# Altium schematic sheet SigGen.SchDoc
size A2
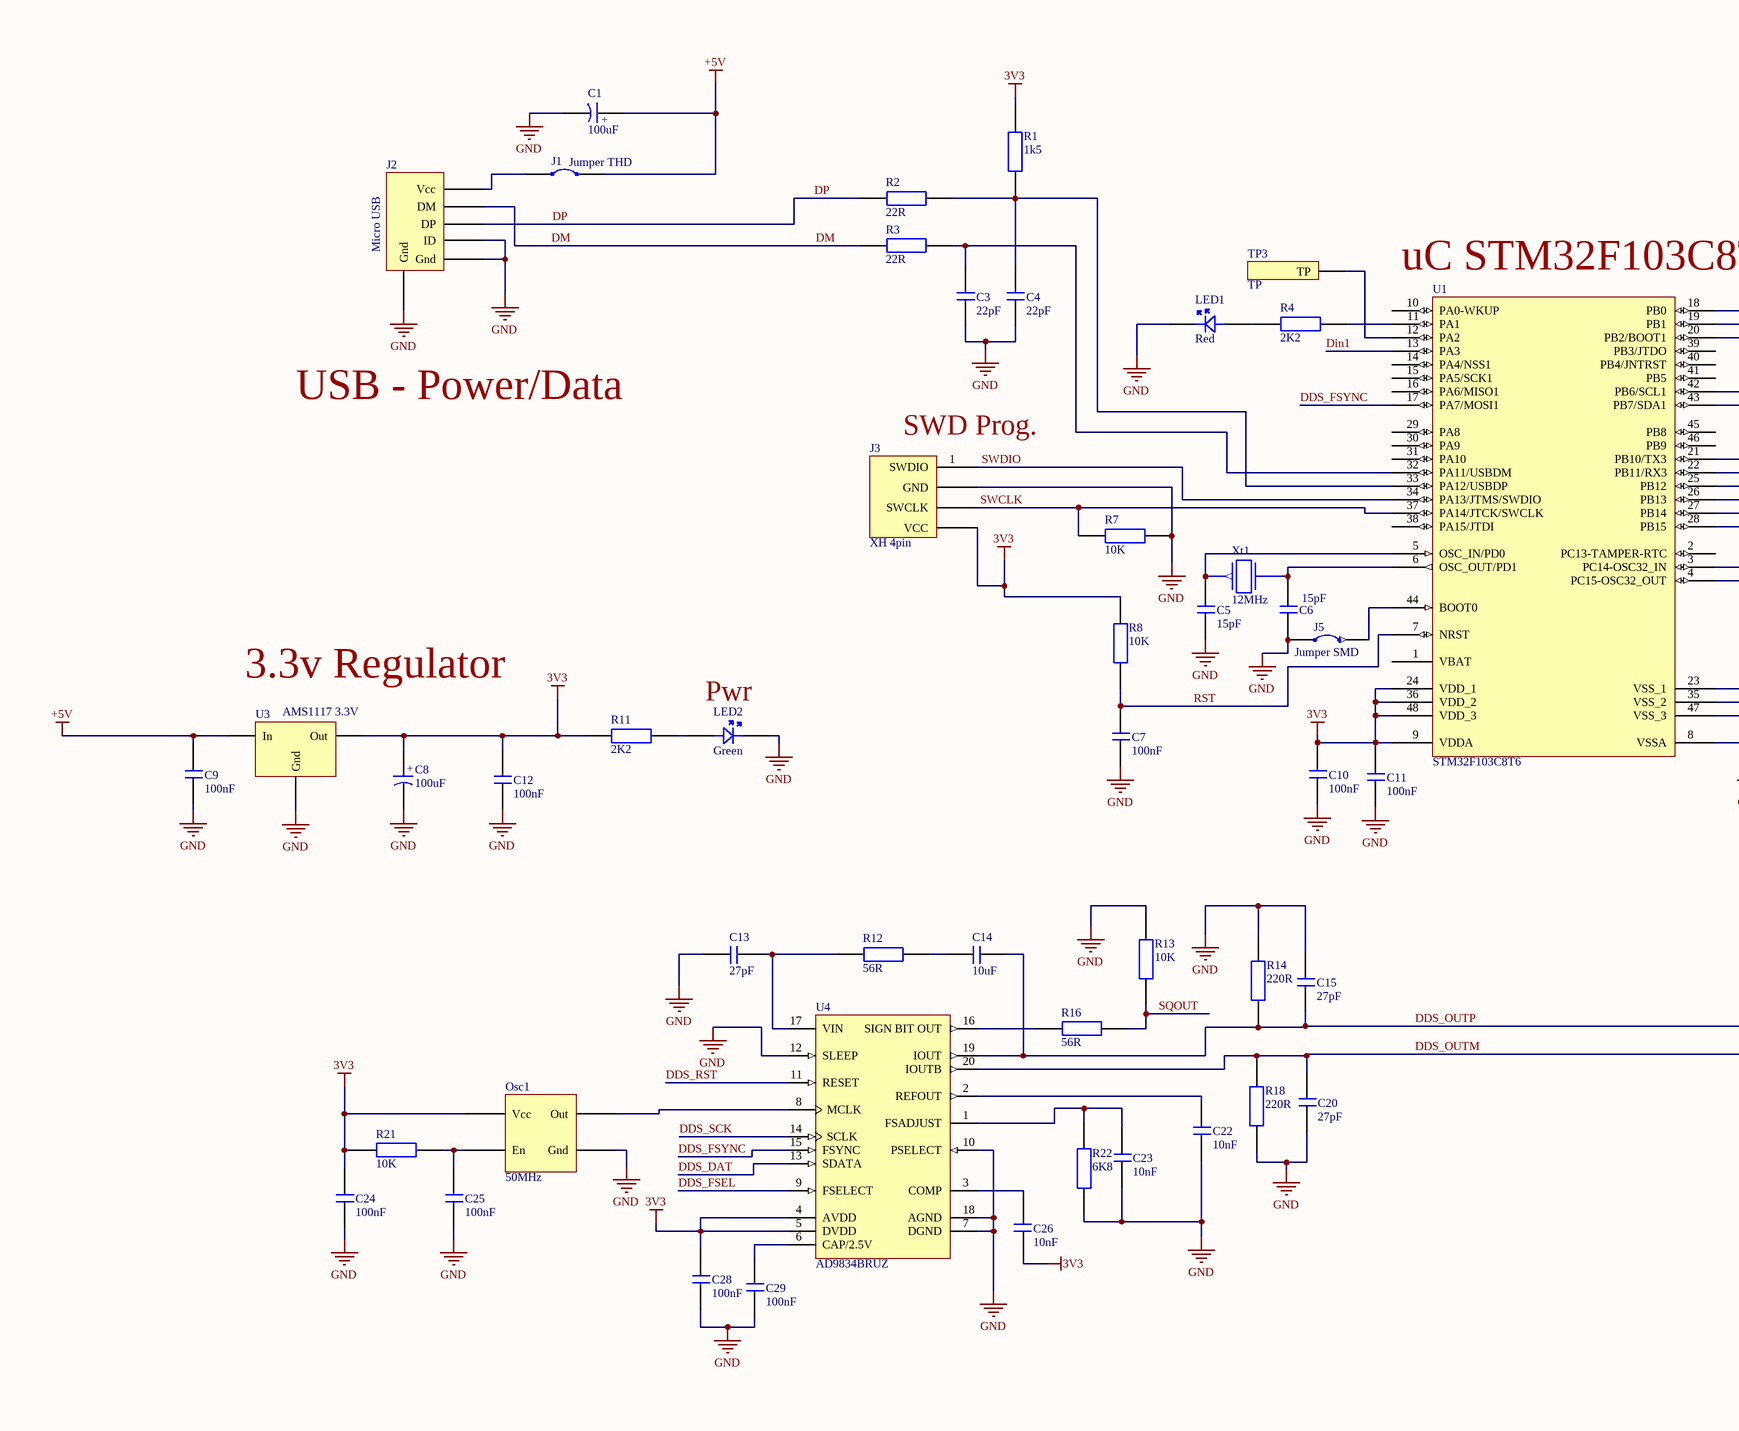
[diagram p0: SigGen.SchDoc, left]
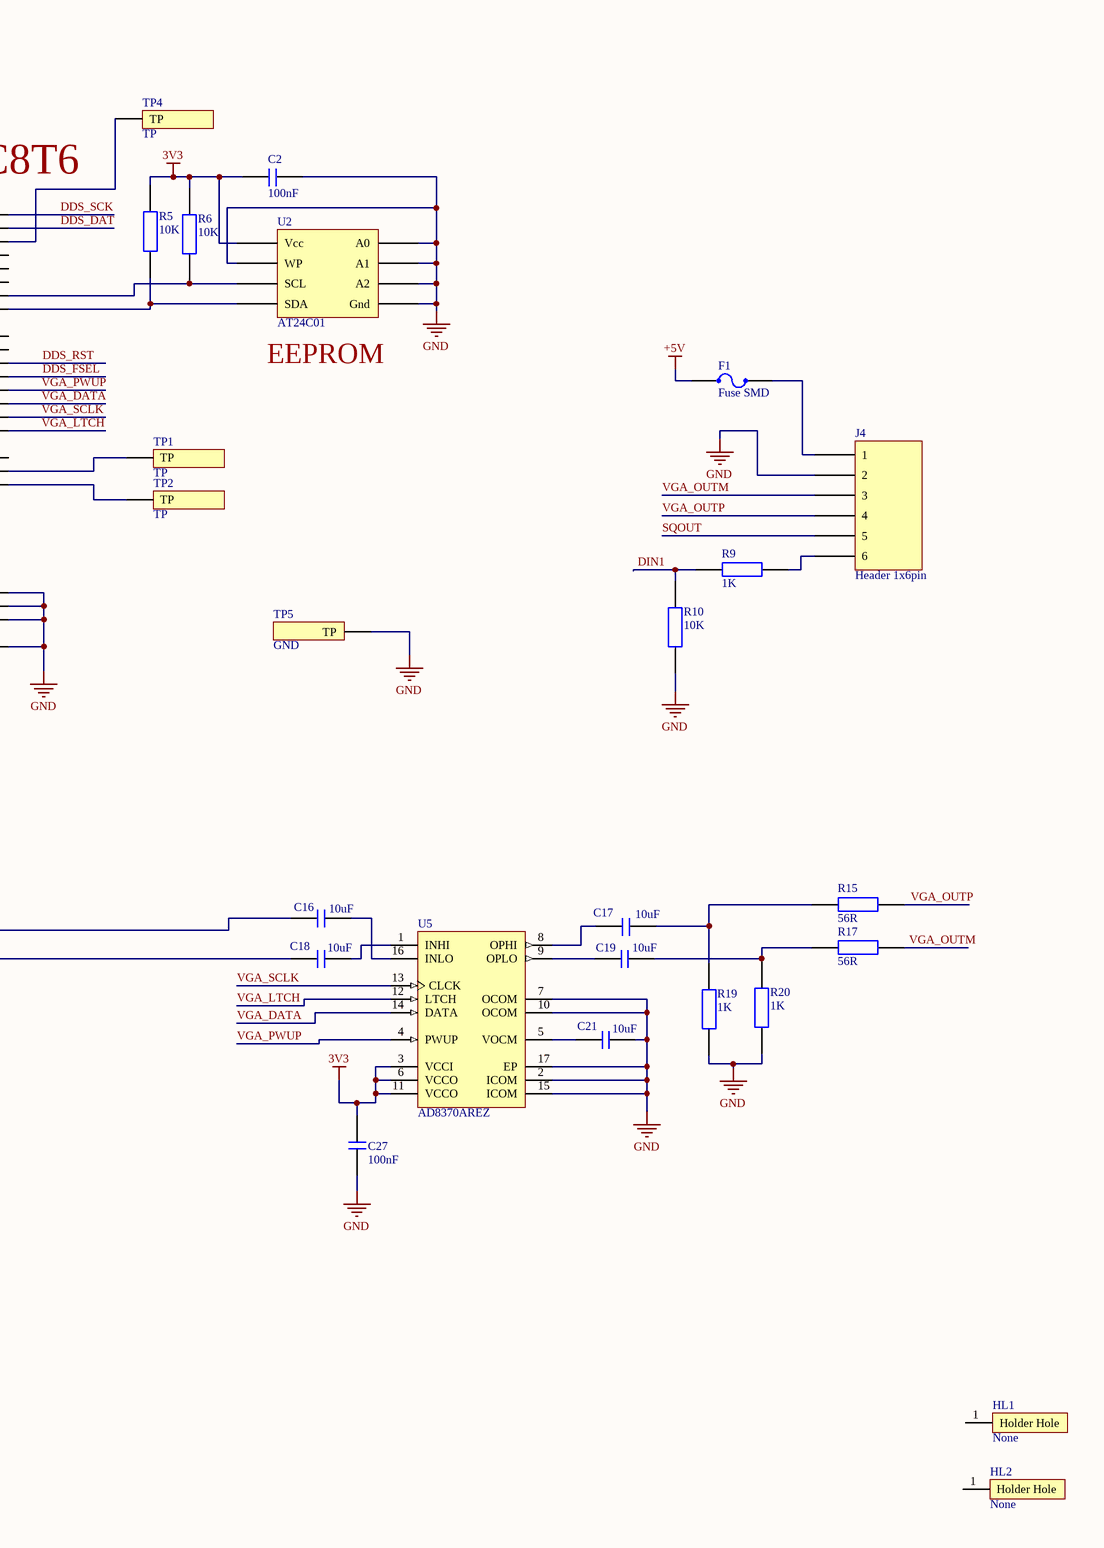
[diagram p1: SigGen.SchDoc, right]

## Parts
C1  100uF  [Cap_Tan_Size_B]
C2  100nF  [CAP_0805]
C3  22pF  [CAP_0805]
C4  22pF  [CAP_0805]
C5  15pF  [CAP_0805]
C6  15pF  [CAP_0805]
C7  100nF  [CAP_0805]
C8  100uF  [Cap_Tan_Size_B]
C9  100nF  [CAP_0805]
C10  100nF  [CAP_0805]
C11  100nF  [CAP_0805]
C12  100nF  [CAP_0805]
C13  27pF  [CAP_0805]
C14  10uF  [CAP_0805]
C15  27pF  [CAP_0805]
C16  10uF  [CAP_0805]
C17  10uF  [CAP_0805]
C18  10uF  [CAP_0805]
C19  10uF  [CAP_0805]
C20  27pF  [CAP_0805]
C21  10uF  [CAP_0805]
C22  10nF  [CAP_0805]
C23  10nF  [CAP_0805]
C24  100nF  [CAP_0805]
C25  100nF  [CAP_0805]
C26  10nF  [CAP_0805]
C27  100nF  [CAP_0805]
C28  100nF  [CAP_0805]
C29  100nF  [CAP_0805]
F1  Fuse SMD  [fuse_1206]
HL1  None  [Holder_hole]  (no BOM)
HL2  None  [Holder_hole]  (no BOM)
J1  Jumper THD  [Jumper_2pin]
J2  Micro USB  [Micro_USB_smd]
J3  XH 4pin  [XH-4pin]
J4  Header 1x6pin  [Header_1x6]
J5  Jumper SMD  [Jumper_smd]  (no BOM)
LED1  Red  [LED_0805_Red]
LED2  Green  [LED_0805_Green]
Osc1  50MHz  [Osc_SMD_5x7]
R1  1k5  [RES_0805]
R2  22R  [RES_0805]
R3  22R  [RES_0805]
R4  2K2  [RES_0805]
R5  10K  [RES_0805]
R6  10K  [RES_0805]
R7  10K  [RES_0805]
R8  10K  [RES_0805]
R9  1K  [RES_0805]
R10  10K  [RES_0805]
R11  2K2  [RES_0805]
R12  56R  [RES_0805]
R13  10K  [RES_0805]
R14  220R  [RES_0805]
R15  56R  [RES_0805]
R16  56R  [RES_0805]
R17  56R  [RES_0805]
R18  220R  [RES_0805]
R19  1K  [RES_0805]
R20  1K  [RES_0805]
R21  10K  [RES_0805]
R22  6K8  [RES_0805]
TP1  TP  [TP]  (no BOM)
TP2  TP  [TP]  (no BOM)
TP3  TP  [TP]  (no BOM)
TP4  TP  [TP]  (no BOM)
TP5  GND  [TP]  (no BOM)
U1  STM32F103C8T6  [STM32F103C8-LQFP-48]
U2  AT24C01  [AT24C01_SOP8]
U3  AMS1117 3.3V  [AMS1117-SOT223]
U4  AD9834BRUZ  [TSSOP-20]
U5  AD8370AREZ  [TSSOP-16-EP]
Xt1  12MHz  [Xtal_SMD]

## Nets
3V3: C2.1 C8.+ C10.2 C11.2 C12.2 C24.2 C26.2 C27.2 C28.2 J3.4(VCC) Osc1.1(Vcc) R1.2 R5.2 R6.2 R8.2 R11.2 R21.2 U1.9(VDDA) U1.24(VDD_1) U1.36(VDD_2) U1.48(VDD_3) U2.8(Vcc) U3.3(Out) U4.4(AVDD) U4.5(DVDD) U5.3(VCCI) U5.6(VCCO) U5.11(VCCO)
+5V: C1.+ C9.2 F1.2 J1.1 U3.1(In)
GND: C1.- C2.2 C3.1 C4.1 C5.1 C6.1 C7.1 C8.- C9.1 C10.1 C11.1 C12.1 C13.1 C15.2 C20.1 C21.2 C22.1 C23.1 C24.1 C25.1 C27.1 C28.1 C29.1 J2.4(ID) J2.5(Gnd) J2.6(Gnd) J3.2(GND) J4.2 J5.2 LED1.2 LED2.2 Osc1.4(Gnd) R7.2 R10.1 R13.2 R14.2 R18.1 R19.1 R20.1 R22.2 TP5.1(TP) U1.8(VSSA) U1.23(VSS_1) U1.35(VSS_2) U1.47(VSS_3) U2.1(A0) U2.2(A1) U2.3(A2) U2.4(Gnd) U2.7(WP) U3.2(Gnd) U4.7(DGND) U4.10(PSELECT) U4.12(SLEEP) U4.18(AGND) U5.2(ICOM) U5.7(OCOM) U5.10(OCOM) U5.15(ICOM) U5.17(EP)
DDS_DAT: U1.19(PB1) U4.13(SDATA)
DDS_FSEL: U1.22(PB11/RX3) U4.9(FSELECT)
DDS_FSYNC: U1.17(PA7/MOSI1) U4.15(FSYNC)
DDS_OUTM: C18.1 C20.2 R18.2 U4.20(IOUTB)
DDS_OUTP: C14.2 C15.1 C16.1 R14.1 U4.19(IOUT)
DDS_RST: U1.21(PB10/TX3) U4.11(RESET)
DDS_SCK: U1.18(PB0) U4.14(SCLK)
DIN1: R9.1 R10.2 U1.13(PA3)
DM: J2.2(DM) R3.2
DP: J2.3(DP) R2.2
RST: C7.2 R8.1 U1.7(NRST)
SQOUT: J4.5 R13.1 R16.2
SWCLK: J3.3(SWCLK) R7.1 U1.37(PA14/JTCK/SWCLK)
SWDIO: J3.1(SWDIO) U1.34(PA13/JTMS/SWDIO)
VGA_DATA: U1.26(PB13) U5.14(DATA)
VGA_LTCH: U1.28(PB15) U5.12(LTCH)
VGA_OUTM: J4.3 R17.2
VGA_OUTP: J4.4 R15.2
VGA_PWUP: U1.25(PB12) U5.4(PWUP)
VGA_SCLK: U1.27(PB14) U5.13(CLCK)
NetC3_2: C3.2 R3.1 U1.32(PA11/USBDM)
NetC4_2: C4.2 R1.1 R2.1 U1.33(PA12/USBDP)
NetC5_2: C5.2 U1.5(OSC_IN/PD0) Xt1.1
NetC6_2: C6.2 U1.6(OSC_OUT/PD1) Xt1.2
NetC13_2: C13.2 R12.1 U4.17(VIN)
NetC14_1: C14.1 R12.2
NetC16_2: C16.2 U5.16(INLO)
NetC17_1: C17.1 U5.8(OPHI)
NetC17_2: C17.2 R15.1 R19.2
NetC18_2: C18.2 U5.1(INHI)
NetC19_1: C19.1 U5.9(OPLO)
NetC19_2: C19.2 R17.1 R20.2
NetC21_1: C21.1 U5.5(VOCM)
NetC22_2: C22.2 U4.2(REFOUT)
NetC23_2: C23.2 R22.1 U4.1(FSADJUST)
NetC25_2: C25.2 Osc1.2(En) R21.1
NetC26_1: C26.1 U4.3(COMP)
NetC29_2: C29.2 U4.6(CAP/2.5V)
NetF1_1: F1.1 J4.1
NetJ1_2: J1.2 J2.1(Vcc)
NetJ4_6: J4.6 R9.2
NetJ5_1: J5.1 U1.44(BOOT0)
NetLED1_1: LED1.1 R4.2
NetLED2_1: LED2.1 R11.1
NetOsc1_3: Osc1.3(Out) U4.8(MCLK)
NetR4_1: R4.1 U1.11(PA1)
NetR5_1: R5.1 U1.43(PB7/SDA1) U2.5(SDA)
NetR6_1: R6.1 U1.42(PB6/SCL1) U2.6(SCL)
NetR16_1: R16.1 U4.16(SIGN_BIT_OUT)
NetTP1_1: TP1.1(TP) U1.3(PC14-OSC32_IN)
NetTP2_1: TP2.1(TP) U1.4(PC15-OSC32_OUT)
NetTP3_1: TP3.1(TP) U1.12(PA2)
NetTP4_1: TP4.1(TP) U1.20(PB2/BOOT1)

Not connected (* = marked no-connect by the designer): HL1 1(Holder_Hole); HL2 1(Holder_Hole); U1 1(VBAT) 2(PC13-TAMPER-RTC) 10(PA0-WKUP) 14(PA4/NSS1) 15(PA5/SCK1) 16(PA6/MISO1) 29(PA8) 30(PA9) 31(PA10) 38(PA15/JTDI) 39(PB3/JTDO) 40(PB4/JNTRST) 41(PB5) 45(PB8) 46(PB9)

## Notes on the sheet
- (near U1) uC STM32F103C8T6
- USB - Power/Data
- (near J3) SWD Prog.
- (near U2) EEPROM
- (near U3) 3.3v Regulator
- (near LED2) Pwr

## Library data of the parts
C1 C8 = Cap_Tant_B: Capacitor SMD Tantalium Size B
C2-C7 C9-C29 = Cap0805: Capacitor SMD 0805
F1 = Fuse1206: Fuse SMD 1206
HL1 HL2 = Holder_Hole: PCB Holder Hole
J1 = Jumper DIP: Jumper pin header + jumper 2pin pirch=2.54mm
J2 = MicroUSB_SMD: Micro USB Female connector SMD; pin to pad: 1>VBUS 2>DM 3>DP 4>ID 5>G 6>GND
J3 = Con_XH_4pin: Connector XH Female 4-pin
J4 = Header_1x6: Header 6-pin
J5 = Jump_smd
LED1 = LED_0805_Red: LED SMD 0805 Red
LED2 = LED_0805_Green: LED SMD 0805 Green
Osc1 = Osc_SMD: Oscillator SMD 5x7; pin to pad: 1>Vcc 2>EN 3>Out 4>Gnd
R1-R22 = Res0805: Resistor SMD 0805
TP1-TP5 = TP: Test point
U1 = STM32F103C8T6: STM32 ARM-based 32-bit MCU with 64 Kbytes Flash, 48-pin LQFP, Industrial Temperature; pin to pad: 1>VBAT 2>PC13 3>PC14 4>PC15 5>OSC_IN 6>OSC_OUT 7>NRST 8>VSSA 9>VDDA 10>PA0 11>PA1 12>PA2 13>PA3 14>PA4 15>PA5 16>PA6 17>PA7 18>PB0 19>PB1 20>PB2 21>PB10 22>PB11 23>VSS_1 24>VDD_1 25>PB12 26>PB13 27>PB14 28>PB15 29>PA8 30>PA9 31>PA10 32>PA11 33>PA12 34>PA13 35>VSS_2 36>VDD_2 37>PA14 38>PA15 39>PB3 40>PB4 41>PB5 42>PB6 43>PB7 44>BOOT0 45>PB8 46>PB9 47>VSS_3 48>VDD_3; Published: 30-May-2008; DatasheetVersion: rev6, Mar-2008; PackageVersion: Mar-2008; PackageReference: LQFP48; Publisher: Altium Limited; PackageDescription: 48-Pin Low-Profile Quad Flat Pack, 7 x 7 mm Body, 0.5 mm Pitch (LQFP48); ComponentLink1Description: Manufacturer Link; ComponentLink1URL: www.st.com/stm32; ComponentLink2Description: Datasheet; ComponentLink2URL: http://www.st.com/stonline/products/literature/ds/13587.pdf
U2 = AT24C01: AT24C01 EEPROM SMD SO8; pin to pad: 1>A0 2>A1 3>A2 4>Gnd 5>SDA 6>SCL 7>WP 8>Vcc
U3 = AMS1117-SOT223: AMS1117 Regulator 3.3V SMD SOT223; pin to pad: 1>In 2>Gnd_Adj 3>Out
U4 = AD9834BRUZ: 20 mW Power, 2.3 V to 5.5 V, 75 MHz Complete DDS, 10-Bit, Serial, RU-20, 75 Tube, Pb-Free; Master fclk: 75MHz; Resolution (Bits): 10bit; Tuning Word Width (bits): 28bit; REFCLK Multiplier: No; Compliance Range (V): 800mV; FS Iout (mA nom): 3mA; I Supply total (max): 8.7mA; DatasheetVersion: Rev. C; PackageVersion: 2000; PackageReference: RU-20; PackageDescription: 20-Lead Thin Shrink Small Outline Package [TSSOP]; I/O Interface: Serial; Code_JEDEC: MO-153AC; ComponentLink1Description: Manufacturer URL; ComponentLink1URL: www.analog.com; ComponentLink2Description: Datasheet; ComponentLink2URL: http://www.analog.com/static/imported-files/data_sheets/AD9834.pdf; ComponentLink3Description: Package Specification; ComponentLink3URL: http://www.analog.com/static/imported-files/packages/364515793657813558433715854054607941441RU20.pdf
U5 = AD8370AREZ: LF to 750 MHz, Digitally Controlled VGA, 34dB, 5.5V, 78mA, RE-16-2, Pb-Free, 96 Tube; -3 dB BW: 750MHz; Distortion (2nd): 65dBc; Distortion (3rd): 62dBc; Output IP3: 31dBm; Noise Figure: 7.4dB; Spectral Noise: 2.1(nV/rtHz); DatasheetVersion: Rev. B; PackageVersion: 050806-A; PackageReference: RE-16-2; PackageDescription: 16-Lead Thin Shrink Small Outline With Exposed Pad [TSSOP_EP]; Gain: 34dB; Supply Voltage (V): 5.5V; Code_JEDEC: MO-153-ABT; ComponentLink1Description: Manufacturer URL; ComponentLink1URL: www.analog.com; ComponentLink2Description: Datasheet; ComponentLink2URL: http://www.analog.com/static/imported-files/data_sheets/AD8370.pdf; ComponentLink3Description: Package Specification; ComponentLink3URL: http://www.analog.com/static/imported-files/packages/PKG_PDF/TSSOP_EP(RE)/RE_16_2.pdf
Xt1 = Xtal_SMD: Crystal Oscillator SMD